# EAGLE schematic Battery Checker (EAGLE 8.6.0)
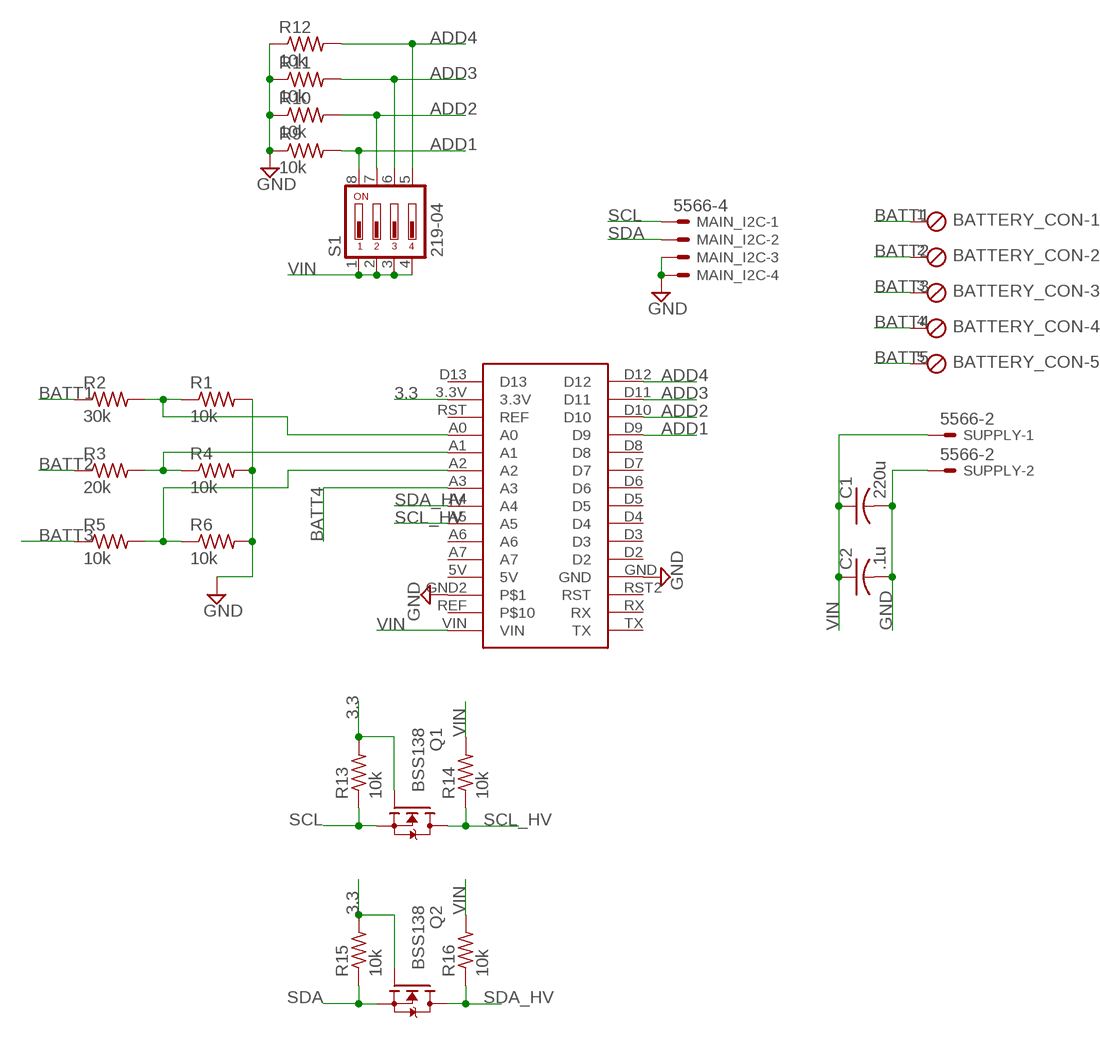
[diagram p0: schematic, sheet 1]

## Parts
BATTERY_CON  MPT5  [5POL254]
C1  220u  C-USC1206  [C1206]
C2  .1u  C-USC1206  [C1206]
MAIN_I2C  5566-4  [5566-4]
Q1  BSS138  [SOT23]
Q2  BSS138  [SOT23]
R1  10k  R-US_R1206  [R1206]
R2  30k  R-US_R1206  [R1206]
R3  20k  R-US_R1206  [R1206]
R4  10k  R-US_R1206  [R1206]
R5  10k  R-US_R1206  [R1206]
R6  10k  R-US_R1206  [R1206]
R9  10k  R-US_R1206  [R1206]
R10  10k  R-US_R1206  [R1206]
R11  10k  R-US_R1206  [R1206]
R12  10k  R-US_R1206  [R1206]
R13  10k  R-US_R1206  [R1206]
R14  10k  R-US_R1206  [R1206]
R15  10k  R-US_R1206  [R1206]
R16  10k  R-US_R1206  [R1206]
S1  219-04  [CTS-219-04]
SUPPLY  5566-2  [5566-2]
U$1  ARDUINO_NANO  [ADUINO_NANO]

## Nets
3.3: Q1.1(G) Q2.1(G) R13.2 R15.2 U$1.3.3V
ADD1: R9.2 S1.8 U$1.D9
ADD2: R10.2 S1.7 U$1.D10
ADD3: R11.2 S1.6 U$1.D11
ADD4: R12.2 S1.5 U$1.D12
BATT1: BATTERY_CON.1 R2.1
BATT2: BATTERY_CON.2 R3.1
BATT3: BATTERY_CON.3 R5.1
BATT4: BATTERY_CON.4 U$1.A3
BATT5: BATTERY_CON.5
GND: C1.2 C2.2 MAIN_I2C.3 MAIN_I2C.4 R1.2 R4.2 R6.2 R9.1 R10.1 R11.1 R12.1 SUPPLY.2 U$1.GND U$1.GND2
N$1: R1.1 R2.2 U$1.A0
N$2: R3.2 R4.1 U$1.A1
N$3: R5.2 R6.1 U$1.A2
SCL: MAIN_I2C.1 Q1.2(S) R13.1
SCL_HV: Q1.3(D) R14.1 U$1.A5
SDA: MAIN_I2C.2 Q2.2(S) R15.1
SDA_HV: Q2.3(D) R16.1 U$1.A4
VIN: C1.1 C2.1 R14.2 R16.2 S1.1 S1.2 S1.3 S1.4 SUPPLY.1 U$1.VIN
Unconnected: U$1.A6 U$1.A7 U$1.D2 U$1.D3 U$1.D4 U$1.D5 U$1.D6 U$1.D7 U$1.D8 U$1.D13 U$1.RST2(RST) U$1.RST(REF) U$1.RX U$1.TX

## Power pins joined to a net without a drawn wire
5V: U$1.5V
P$10: U$1.REF

## Library data of the parts
BATTERY_CON = con-phoenix-254:MPT5: PHOENIX CONNECTOR; OC_FARNELL: unknown; OC_NEWARK: unknown
C1 C2 = rcl:C-US: CAPACITOR, American symbol; SPICEPREFIX: C
MAIN_I2C = con-molex:5566-4: Mini FIT connector 4 pol Source: http://www.molex.com; MF: MOLEX; OC_FARNELL: unknown; OC_NEWARK: unknown
Q1 Q2 = bss138_10:BSS138: BSS138 N-Channel Logic Level Enhancement Mode Field Effect Transistor Source: http://www.fairchildsemi.com/datasheets/BS/BSS138.pdf; MF: Fairchild; MPN: BSS138; OC_FARNELL: 9845330; OC_NEWARK: 67R2009
R1-R6 R9-R16 = rcl:R-US_: RESISTOR, American symbol; SPICEPREFIX: R
S1 = switch-dil:219-04*: Surface Mount DIP Switch Series 219 SMT CTS Electronic Components Sourc: www.ctscorp.com; OC_FARNELL: unknown; OC_NEWARK: unknown
SUPPLY = con-molex:5566-2: Mini FIT connector 2 pol Source: http://www.molex.com; MF: MOLEX; OC_FARNELL: 1822072; OC_NEWARK: unknown
U$1 = Arduino Nano:ARDUINO_NANO